# EasyEDA schematic Prise_Wifi_HG.json
TITLE: Sheet_1; REV: 1.0; Date: 2021-01-05; Sheet: 1/1; Drawn By: Ione_Disgrizzly; Company: Your Company
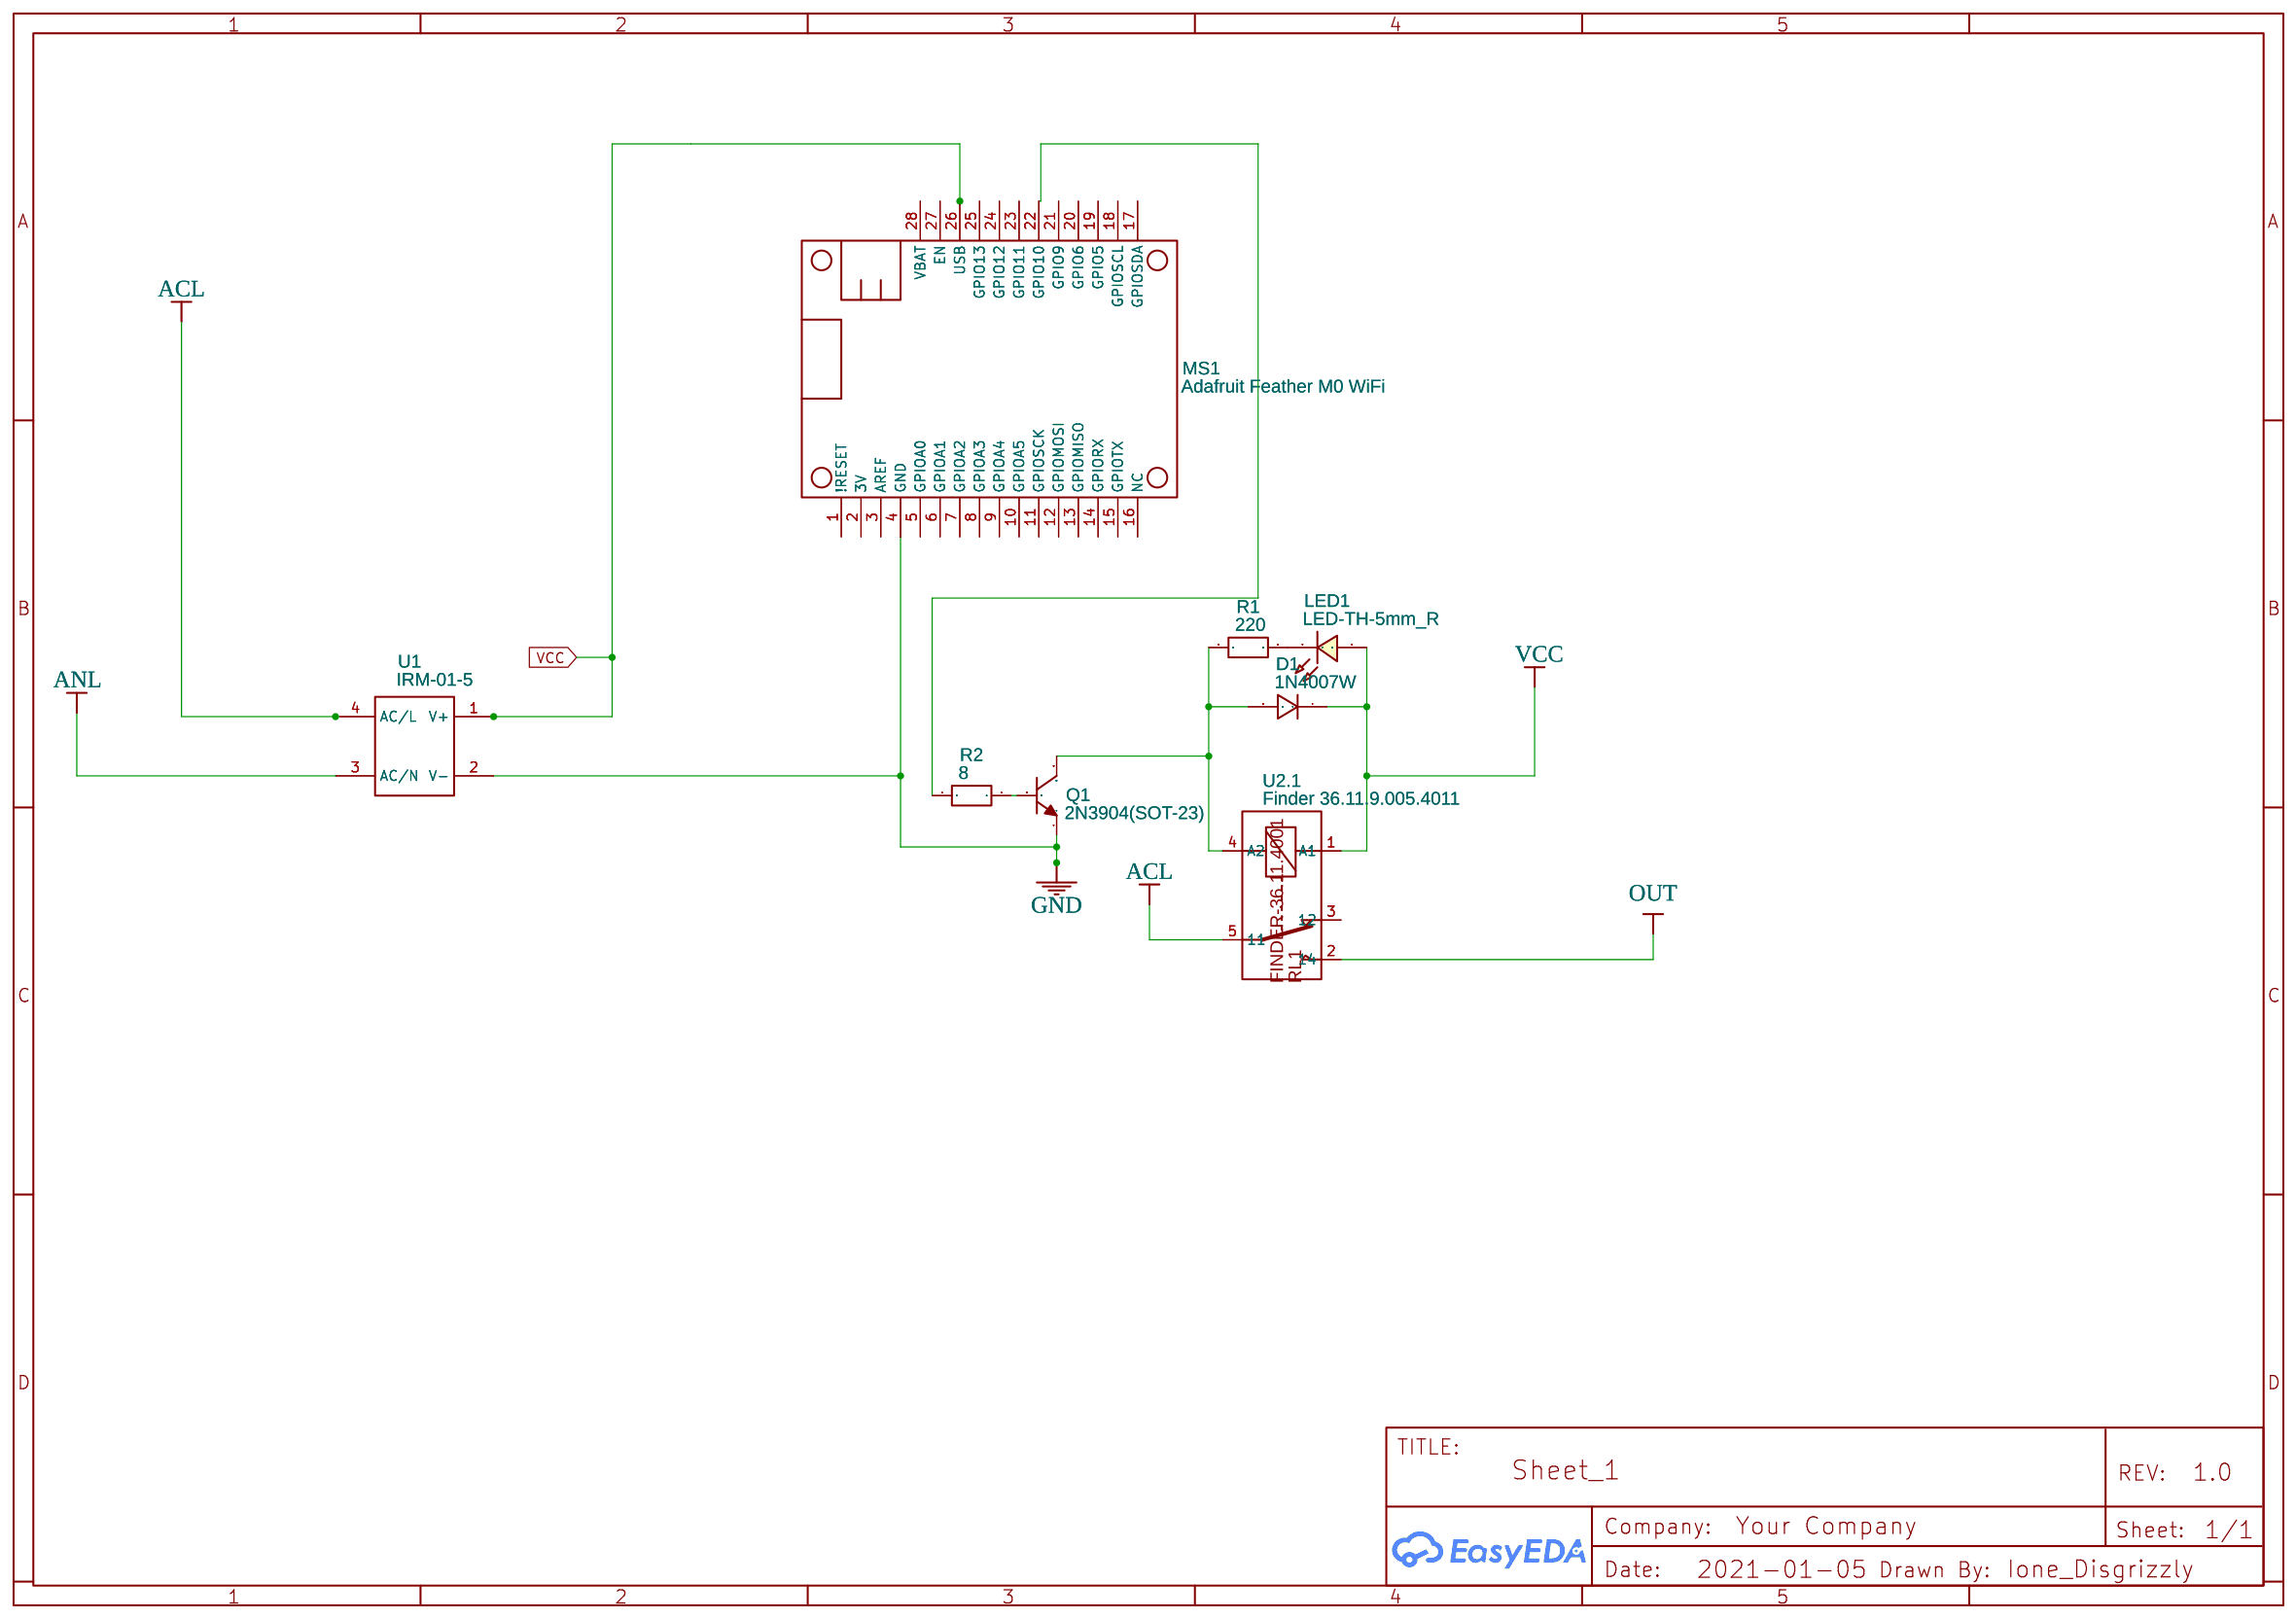
[diagram p0: schematic sheet]

## Parts
D1  1N4007W  [SOD-123_L2.8-W1.8-LS3.7-RD]
LED1  LED-TH-5mm_R  [LED-TH_BD5.0_RED]
MS1  Adafruit Feather M0 WiFi  [ADAFRUIT FEATHER M0 WIFI]
Q1  2N3904(SOT-23)  [SOT-23-3_L2.9-W1.3-P1.90-LS2.4-TR]
R1  220  [RES-TH_BD1.8-L3.2-P7.20-D0.4]
R2  8  [RES-TH_BD1.8-L3.2-P7.20-D0.4]
U1  IRM-01-5  [IRM-01-5]
U2  Finder 36.11.9.005.4011  [FINDER 36.11.9.005.4011]  (section 1)

## Library data of the parts
D1 = 1N4007W: Supplier: LCSC; Supplier Part: C328592; Manufacturer: BLUE ROCKET; Contributor: LCEDA_Lib
LED1 = LED-TH-5mm_R: Manufacturer: EVERLIGHT(台湾亿光); Manufacturer Part: 333-2SURD/S530-A3; Supplier Part: C87271; Supplier: LCSC; Contributor: LCEDA_Lib
MS1 = Adafruit Feather M0 WiFi: sourceId: 0S0UN5Zhz
Q1 = 2N3904(SOT-23): Supplier: LCSC; Manufacturer: KEC; Manufacturer Part: 2n3904S-RTK/PS; Supplier Part: C18536; SMT Type: SOT-23; Contributor: LCEDA_Lib
R1 R2 = CF1/6W-18KΩ±5%T52: Supplier: LCSC; Supplier Part: C714235; Manufacturer: Huaxing Mechanical-Elec.; Contributor: LCSC
U1 = IRM-01-5: Manufacturer: MeanWell; link: https://www.meanwell.com/webapp/product/search.aspx?prod=IRM-01; Contributor: vimusov
U2 = Finder 36.11.9.005.4011: Manufacturer: FINDER; Manufacturer Part: 36.11.9.005.4011; Contributor: lionelammi1; subpart_no: 1

## Nets
GND: MS1.4(GND) Q1.1(E) U1.2(V-)
VCC: D1.1 LED1.1 MS1.26(USB) U1.1(V+) U2.1(A1)
ACL: U1.4(AC/L) U2.5(11)
ANL: U1.3(AC/N)
OUT: U2.2(14)
Net-(D1-2): D1.2 Q1.3(C) R1.1 U2.4(A2)
Net-(LED1-2): LED1.2 R1.2
Net-(MS1-22): MS1.22(GPIO10) R2.1
Net-(Q1-2): Q1.2(B) R2.2

Not connected (* = marked no-connect by the designer): MS1 1(!RESET) 2(3V) 3(AREF) 5(GPIOA0) 6(GPIOA1) 7(GPIOA2) 8(GPIOA3) 9(GPIOA4) 10(GPIOA5) 11(GPIOSCK) 12(GPIOMOSI) 13(GPIOMISO) 14(GPIORX) 15(GPIOTX) 16(NC) 17(GPIOSDA) 18(GPIOSCL) 19(GPIO5) 20(GPIO6) 21(GPIO9) 23(GPIO11) 24(GPIO12) 25(GPIO13) 27(EN) 28(VBAT); U2 3(12)
